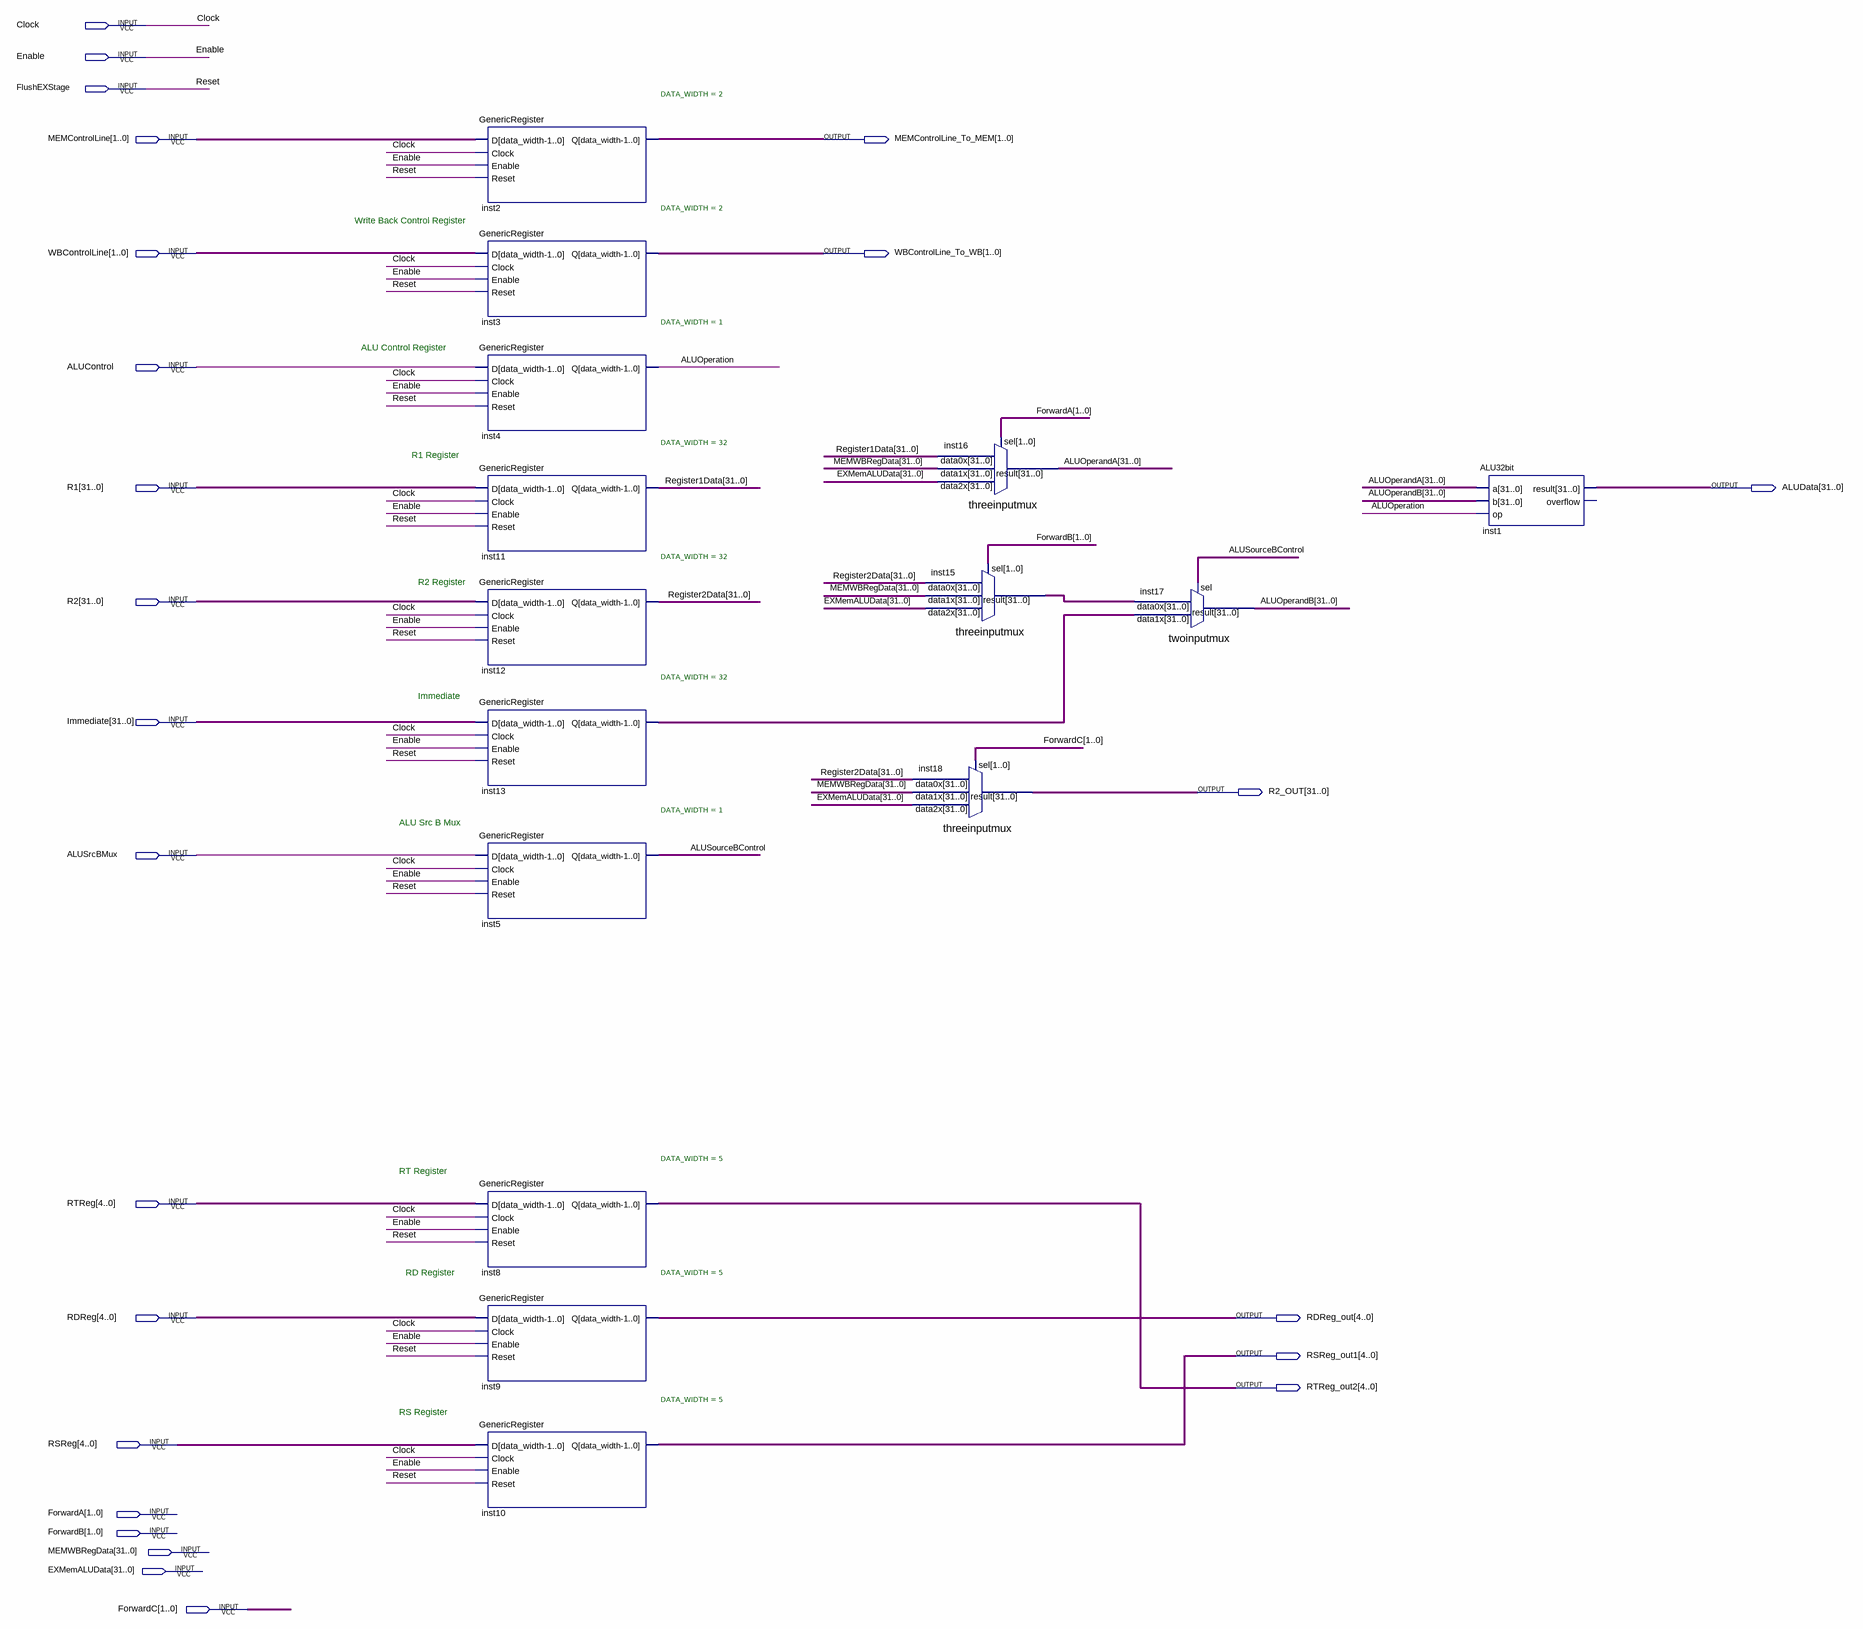
[diagram p0: schematic sheet]
// Quartus schematic Execution_Stage.bdf as structural Verilog: 15 symbols, 25 pins
module Execution_Stage (
  input  Clock,
  input  Enable,
  input  FlushEXStage,
  input  [1:0] MEMControlLine,
  input  [1:0] WBControlLine,
  input  ALUControl,
  input  [31:0] R1,
  input  [31:0] R2,
  input  [31:0] Immediate,
  input  ALUSrcBMux,
  input  [4:0] RTReg,
  input  [4:0] RDReg,
  input  [4:0] RSReg,
  input  [1:0] ForwardA,
  input  [1:0] ForwardB,
  input  [31:0] MEMWBRegData,
  input  [31:0] EXMemALUData,
  input  [1:0] ForwardC,
  output [1:0] MEMControlLine_To_MEM,
  output [1:0] WBControlLine_To_WB,
  output [31:0] ALUData,
  output [31:0] R2_OUT,
  output [4:0] RDReg_out,
  output [4:0] RSReg_out1,
  output [4:0] RTReg_out2
);

  wire ALUOperation, ALUSourceBControl;
  wire [31:0] ALUOperandA, ALUOperandB, inst13_q, inst15_result, Register1Data, Register2Data;

  GenericRegister #(.DATA_WIDTH(2)) inst2 (
    .D(MEMControlLine), .Clock(Clock), .Enable(Enable), .Reset(FlushEXStage), .Q(MEMControlLine_To_MEM));
  GenericRegister #(.DATA_WIDTH(2)) inst3 (
    .D(WBControlLine), .Clock(Clock), .Enable(Enable), .Reset(FlushEXStage), .Q(WBControlLine_To_WB));
  GenericRegister #(.DATA_WIDTH(1)) inst4 (
    .D(ALUControl), .Clock(Clock), .Enable(Enable), .Reset(FlushEXStage), .Q(ALUOperation));
  GenericRegister #(.DATA_WIDTH(32)) inst11 (
    .D(R1), .Clock(Clock), .Enable(Enable), .Reset(FlushEXStage), .Q(Register1Data));
  GenericRegister #(.DATA_WIDTH(32)) inst12 (
    .D(R2), .Clock(Clock), .Enable(Enable), .Reset(FlushEXStage), .Q(Register2Data));
  GenericRegister #(.DATA_WIDTH(32)) inst13 (
    .D(Immediate), .Clock(Clock), .Enable(Enable), .Reset(FlushEXStage), .Q(inst13_q));
  GenericRegister #(.DATA_WIDTH(1)) inst5 (
    .D(ALUSrcBMux), .Clock(Clock), .Enable(Enable), .Reset(FlushEXStage), .Q(ALUSourceBControl));
  GenericRegister #(.DATA_WIDTH(5)) inst8 (
    .D(RTReg), .Clock(Clock), .Enable(Enable), .Reset(FlushEXStage), .Q(RTReg_out2));
  GenericRegister #(.DATA_WIDTH(5)) inst9 (
    .D(RDReg), .Clock(Clock), .Enable(Enable), .Reset(FlushEXStage), .Q(RDReg_out));
  GenericRegister #(.DATA_WIDTH(5)) inst10 (
    .D(RSReg), .Clock(Clock), .Enable(Enable), .Reset(FlushEXStage), .Q(RSReg_out1));
  threeinputmux inst16 (
    .data2x(EXMemALUData), .data1x(MEMWBRegData), .data0x(Register1Data), .sel(ForwardA), .result(ALUOperandA));
  threeinputmux inst15 (
    .data2x(EXMemALUData), .data1x(MEMWBRegData), .data0x(Register2Data), .sel(ForwardB),
    .result(inst15_result));
  threeinputmux inst18 (
    .data2x(EXMemALUData), .data1x(MEMWBRegData), .data0x(Register2Data), .sel(ForwardC), .result(R2_OUT));
  twoinputmux inst17 (.data1x(inst13_q), .data0x(inst15_result), .sel(ALUSourceBControl), .result(ALUOperandB));
  ALU32bit inst1 (.a(ALUOperandA), .b(ALUOperandB), .op(ALUOperation), .result(ALUData));  // open: overflow

  // Other names for the same wires on the sheet: Reset = FlushEXStage

  // Notes on the sheet:
  //   Write Back Control Register
  //   ALU Control Register
  //   R1 Register
  //   R2 Register
  //   Immediate
  //   ALU Src B Mux
  //   RT Register
  //   RD Register
  //   RS Register
endmodule
